# EAGLE board board-scope-R3 (EAGLE 9.0.0), part 1 of 2
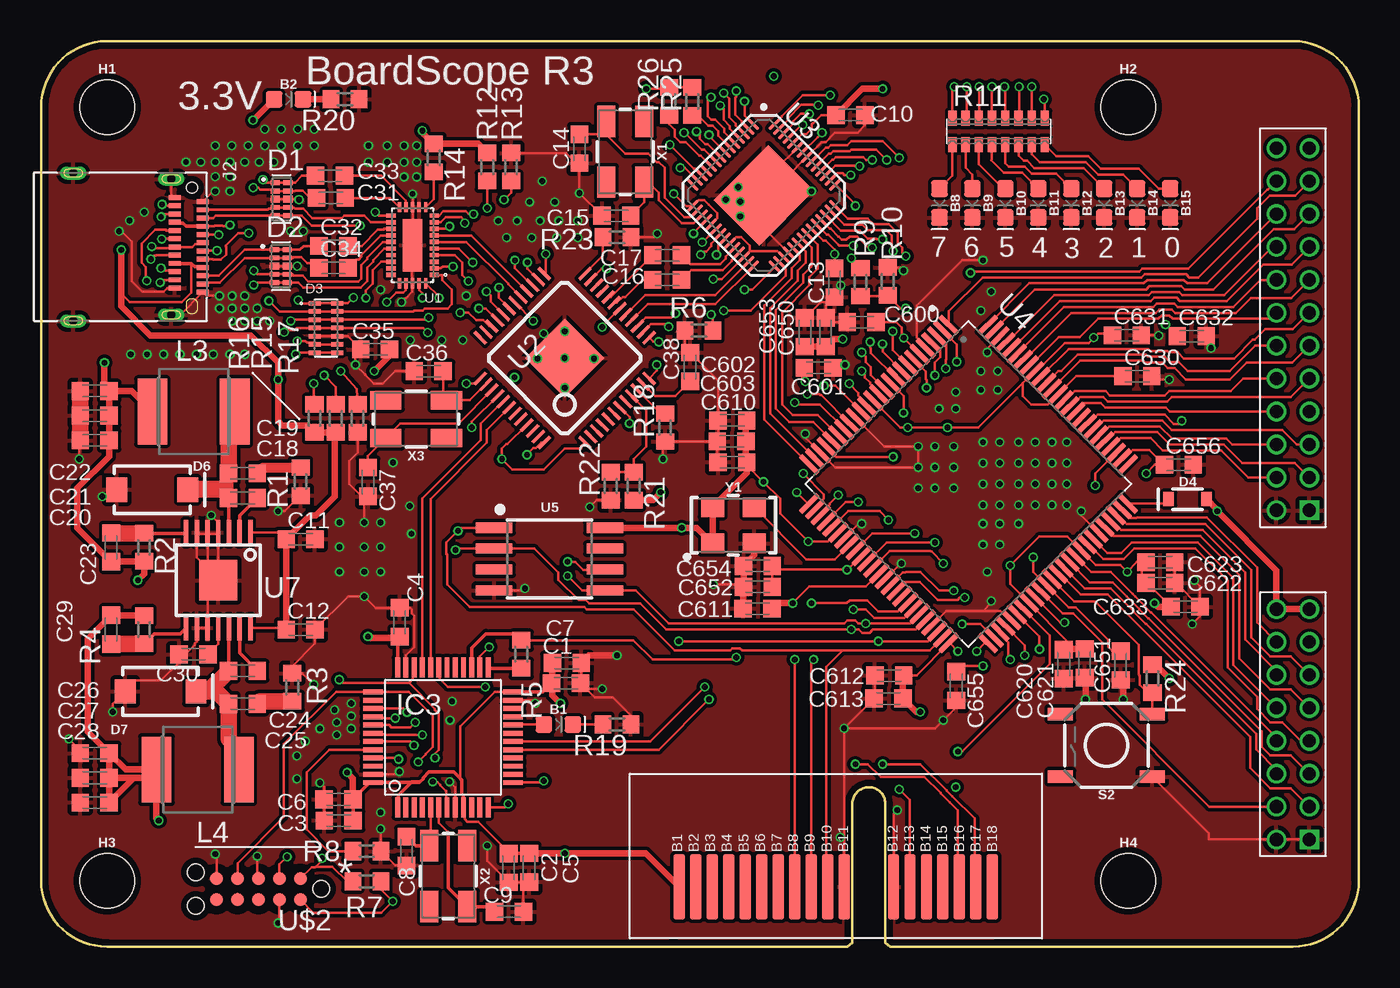
[diagram p5: board, top side]
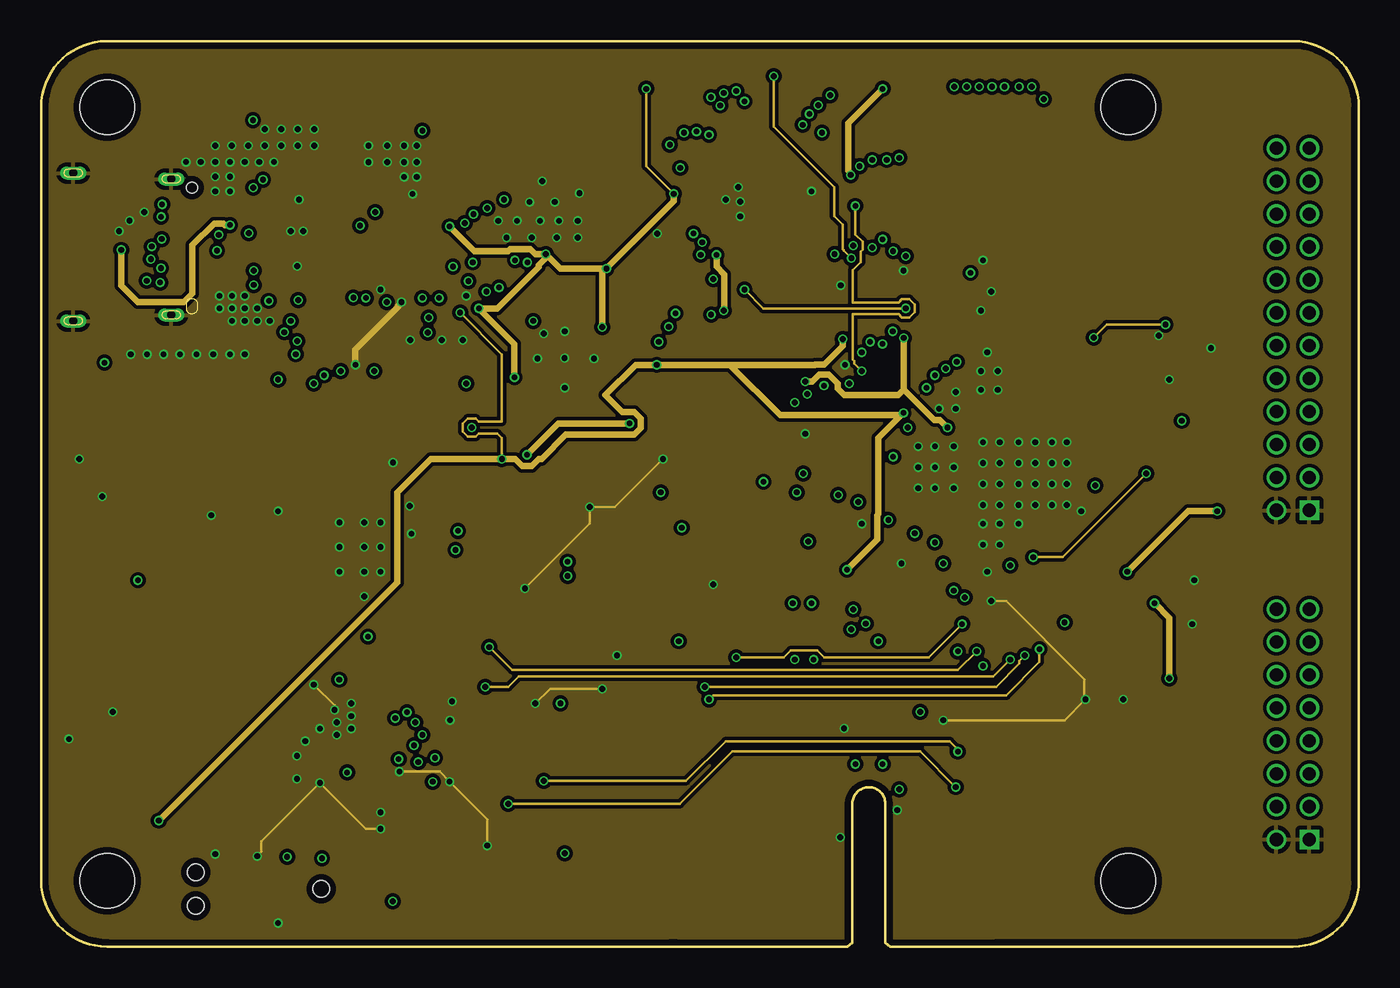
[diagram p6: board, inner layer Route2]
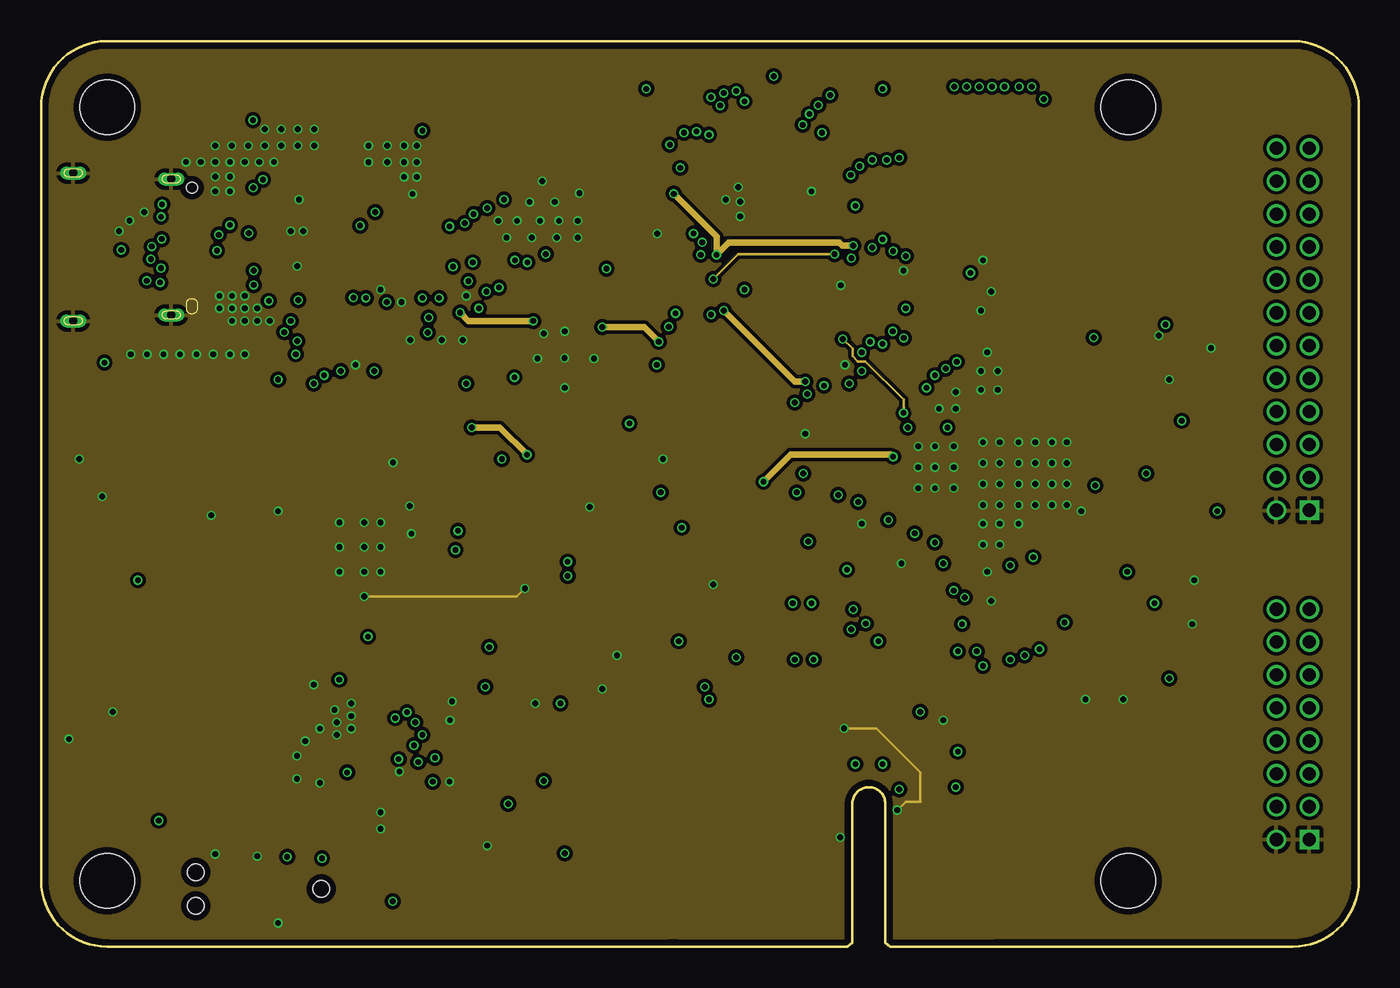
[diagram p7: board, inner layer Route15]
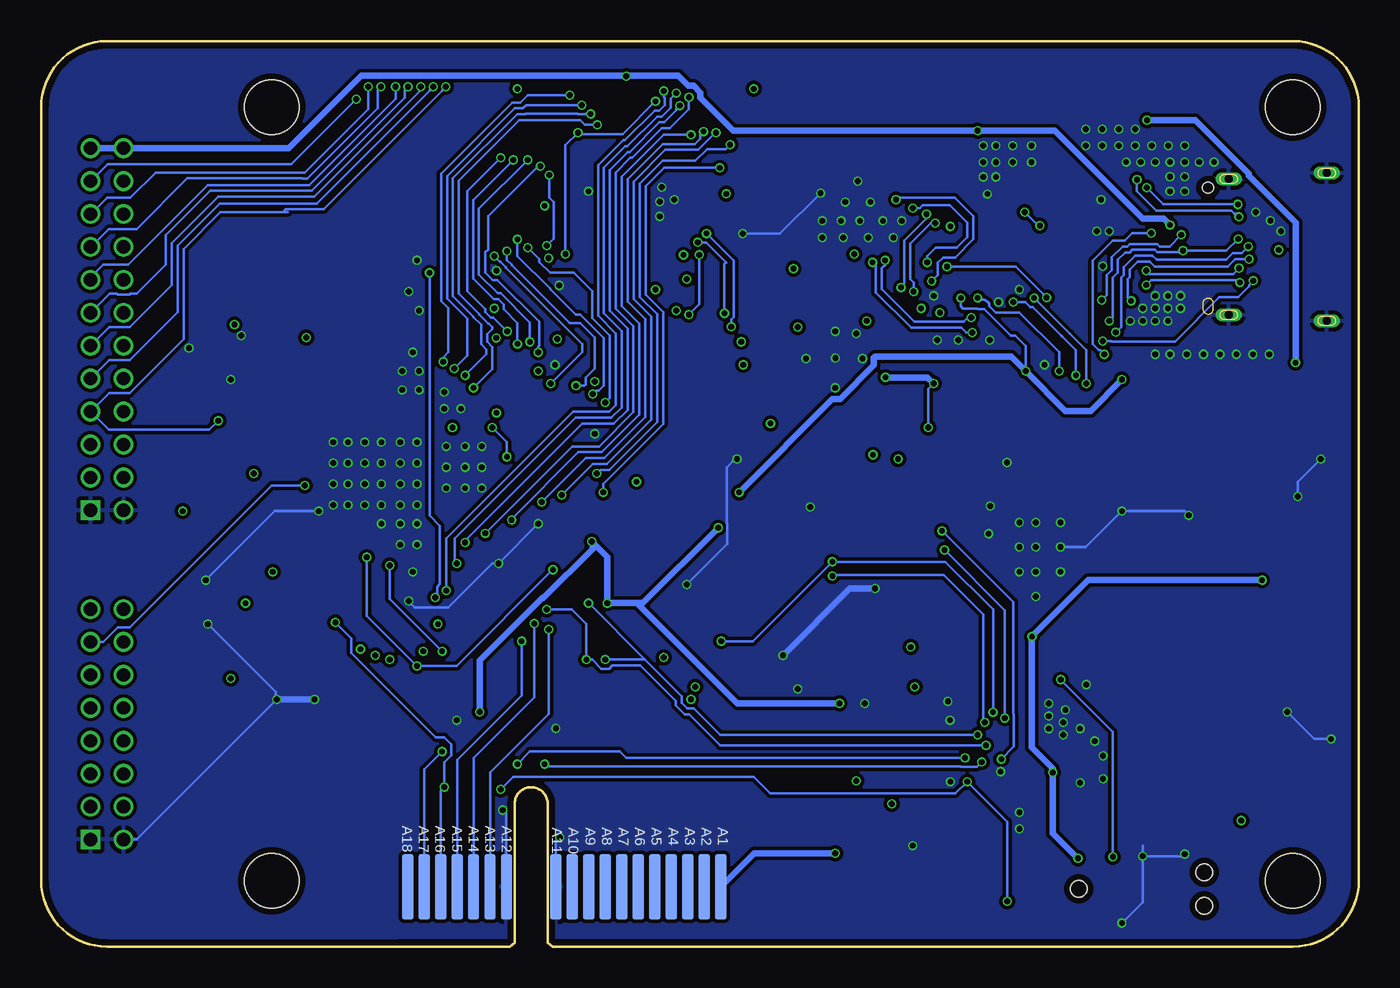
[diagram p8: board, bottom side, seen from below]

Size 80 x 55 mm. Coordinates in mm from the lower left corner, seen from the top.
Outline: 38.5,0 4,0 arc-90 0,4 0,51 arc-90 4,55 76,55 arc-90 80,51 80,4 arc-90 76,0 58,0
Copper layers (1*2*15*16): Top 0.035559375mm / dielectric 0.17018125mm / Route2 0.01778125mm / dielectric 47mil / Route15 0.01778125mm / dielectric 0.17018125mm / Bottom 0.035559375mm
Design rules "oshpark-4layer": minimum track width 5mil, minimum drill 10mil, track to track 5mil, track to pad 5mil, pad to pad 5mil, via to via 5mil, smd to smd 5mil, copper to edge 15mil, drill to drill 6mil, minimum pad ring 4mil, minimum via ring 4mil, stop-mask expansion 2.5mil, vias tented up to drill 0.5mm, thermal gap 10mil
Net classes: 0 default: width 0.152 mm, clearance 0.205 mm

## Footprints (pad centres in the part's own frame; a part is rotated, then mirrored left to right if it is on the bottom)
LED-0603 = smd 1 x 1: A -0.877,0; C 0.877,0
C0603K = smd 1.05 x 1.08: 1 -0.875,0; 2 0.875,0
TI_TPD4E05U06DQAR = smd 0.55 x 0.3: 1 -0.385,1; 2 -0.385,0.5; 4 -0.385,-0.5; 5 -0.385,-1; 6 0.385,-1; 7 0.385,-0.5; 9 0.385,0.5; 10 0.385,1 | smd 0.55 x 0.4: 3 -0.385,0; 8 0.385,0
SON50P135X350X55-14N = smd 0.74 x 0.22: 1 -0.67,1.5; 2 -0.67,1; 3 -0.67,0.5; 4 -0.67,0; 5 -0.67,-0.5; 6 -0.67,-1; 7 -0.67,-1.5; 8 0.67,-1.5; 9 0.67,-1; 10 0.67,-0.5; 11 0.67,0; 12 0.67,0.5; 13 0.67,1; 14 0.67,1.5
SOD-323 = smd 0.63 x 0.83: A 1.15,0; C -1.15,0
SMA-DIODE = smd 1.27 x 1.47: A -2.15,0; C 2.15,0
STAND-OFF = hole 3.302: 0,0
LQFP48 = smd 0.3 x 1.2: 1 -2.75,-4.25; 2 -2.25,-4.25; 3 -1.75,-4.25; 4 -1.25,-4.25; 5 -0.75,-4.25; 6 -0.25,-4.25; 7 0.25,-4.25; 8 0.75,-4.25; 9 1.25,-4.25; 10 1.75,-4.25; 11 2.25,-4.25; 12 2.75,-4.25; 25 2.75,4.25; 26 2.25,4.25; 27 1.75,4.25; 28 1.25,4.25; 29 0.75,4.25; 30 0.25,4.25; 31 -0.25,4.25; 32 -0.75,4.25; 33 -1.25,4.25; 34 -1.75,4.25; 35 -2.25,4.25; 36 -2.75,4.25 | smd 1.2 x 0.3: 13 4.25,-2.75; 14 4.25,-2.25; 15 4.25,-1.75; 16 4.25,-1.25; 17 4.25,-0.75; 18 4.25,-0.25; 19 4.25,0.25; 20 4.25,0.75; 21 4.25,1.25; 22 4.25,1.75; 23 4.25,2.25; 24 4.25,2.75; 37 -4.25,2.75; 38 -4.25,2.25; 39 -4.25,1.75; 40 -4.25,1.25; 41 -4.25,0.75; 42 -4.25,0.25; 43 -4.25,-0.25; 44 -4.25,-0.75; 45 -4.25,-1.25; 46 -4.25,-1.75; 47 -4.25,-2.25; 48 -4.25,-2.75
AMPHENOL_12401598E4#2A = smd 0.3 x 0.7: A1 -2.75,0.66; A2 -2.25,0.66; A3 -1.75,0.66; A4 -1.25,0.66; A5 -0.75,0.66; A6 -0.25,0.66; A7 0.25,0.66; A8 0.75,0.66; A9 1.25,0.66; A10 1.75,0.66; A11 2.25,0.66; A12 2.75,0.66; B1 2.5,-1.04; B2 2,-1.04; B3 1.5,-1.04; B4 1,-1.04; B5 0.5,-1.04; B6 0,-1.04; B7 -0.5,-1.04; B8 -1,-1.04; B9 -1.5,-1.04; B10 -2,-1.04; B11 -2.5,-1.04; B12 -3,-1.04 | drill 0.5 pad 0.8 long: SH1 -4.13,-1.25; SH2 -4.49,-7.2; SH3 4.49,-7.2; SH4 4.13,-1.25 | hole 0.65: -3.6,0
L5650M = smd 1.8 x 4: 1 -2.5,0; 2 2.5,0
R0603 = smd 1 x 1.1: 1 -0.85,0; 2 0.85,0
CTS743C163 = smd 0.5 x 0.9: 1 -2.8,-0.8; 2 -2,-0.8; 3 -1.2,-0.8; 4 -0.4,-0.8; 5 0.41,-0.8; 6 1.21,-0.8; 7 2.01,-0.8; 8 2.81,-0.8; 9 2.81,0.8; 10 2.01,0.8; 11 1.21,0.8; 12 0.41,0.8; 13 -0.4,0.8; 14 -1.2,0.8; 15 -2,0.8; 16 -2.8,0.8
TACTILE_SWITCH_SMD_5.2MM = smd 1.524 x 0.762: 1 -2.794,1.905; 2 2.794,1.905; 3 -2.794,-1.905; 4 2.794,-1.905
QFN40P450X250X80-31N120X320 = smd 0.58 x 0.22: 1 -1.315,1.8; 2 -1.315,1.4; 3 -1.315,1; 4 -1.315,0.6; 5 -1.315,0.2; 6 -1.315,-0.2; 7 -1.315,-0.6; 8 -1.315,-1; 9 -1.315,-1.4; 10 -1.315,-1.8; 16 1.315,-1.8; 17 1.315,-1.4; 18 1.315,-1; 19 1.315,-0.6; 20 1.315,-0.2; 21 1.315,0.2; 22 1.315,0.6; 23 1.315,1; 24 1.315,1.4; 25 1.315,1.8 | smd 0.22 x 0.58: 11 -0.8,-2.315; 12 -0.4,-2.315; 13 0,-2.315; 14 0.4,-2.315; 15 0.8,-2.315; 26 0.8,2.315; 27 0.4,2.315; 28 0,2.315; 29 -0.4,2.315; 30 -0.8,2.315 | smd 1.2 x 3.2: 31 0,0
TQFP48 = smd 0.2 x 1: 1 -2.75,-4.5; 2 -2.25,-4.5; 3 -1.75,-4.5; 4 -1.25,-4.5; 5 -0.75,-4.5; 6 -0.25,-4.5; 7 0.25,-4.5; 8 0.75,-4.5; 9 1.25,-4.5; 10 1.75,-4.5; 11 2.25,-4.5; 12 2.75,-4.5; 25 2.75,4.5; 26 2.25,4.5; 27 1.75,4.5; 28 1.25,4.5; 29 0.75,4.5; 30 0.25,4.5; 31 -0.25,4.5; 32 -0.75,4.5; 33 -1.25,4.5; 34 -1.75,4.5; 35 -2.25,4.5; 36 -2.75,4.5 | smd 1 x 0.2: 13 4.5,-2.75; 14 4.5,-2.25; 15 4.5,-1.75; 16 4.5,-1.25; 17 4.5,-0.75; 18 4.5,-0.25; 19 4.5,0.25; 20 4.5,0.75; 21 4.5,1.25; 22 4.5,1.75; 23 4.5,2.25; 24 4.5,2.75; 37 -4.5,2.75; 38 -4.5,2.25; 39 -4.5,1.75; 40 -4.5,1.25; 41 -4.5,0.75; 42 -4.5,0.25; 43 -4.5,-0.25; 44 -4.5,-0.75; 45 -4.5,-1.25; 46 -4.5,-1.75; 47 -4.5,-2.25; 48 -4.5,-2.75 | smd 3.4 x 3.4: P$1 0,0
VQFN-56-7MM = smd 1 x 0.2: 1 -3.55,2.6; 2 -3.55,2.2; 3 -3.55,1.8; 4 -3.55,1.4; 5 -3.55,1; 6 -3.55,0.6; 7 -3.55,0.2; 8 -3.55,-0.2; 9 -3.55,-0.6; 10 -3.55,-1; 11 -3.55,-1.4; 12 -3.55,-1.8; 13 -3.55,-2.2; 14 -3.55,-2.6; 29 3.55,-2.6; 30 3.55,-2.2; 31 3.55,-1.8; 32 3.55,-1.4; 33 3.55,-1; 34 3.55,-0.6; 35 3.55,-0.2; 36 3.55,0.2; 37 3.55,0.6; 38 3.55,1; 39 3.55,1.4; 40 3.55,1.8; 41 3.55,2.2; 42 3.55,2.6 | smd 0.2 x 1: 15 -2.6,-3.55; 16 -2.2,-3.55; 17 -1.8,-3.55; 18 -1.4,-3.55; 19 -1,-3.55; 20 -0.6,-3.55; 21 -0.2,-3.55; 22 0.2,-3.55; 23 0.6,-3.55; 24 1,-3.55; 25 1.4,-3.55; 26 1.8,-3.55; 27 2.2,-3.55; 28 2.6,-3.55; 43 2.6,3.55; 44 2.2,3.55; 45 1.8,3.55; 46 1.4,3.55; 47 1,3.55; 48 0.6,3.55; 49 0.2,3.55; 50 -0.2,3.55; 51 -0.6,3.55; 52 -1,3.55; 53 -1.4,3.55; 54 -1.8,3.55; 55 -2.2,3.55; 56 -2.6,3.55 | smd 3.9 x 4.7: PAD 0,0
QFP50P1600X1600X120-100N = smd 1.47 x 0.28: 1 -7.67,6; 2 -7.67,5.5; 3 -7.67,5; 4 -7.67,4.5; 5 -7.67,4; 6 -7.67,3.5; 7 -7.67,3; 8 -7.67,2.5; 9 -7.67,2; 10 -7.67,1.5; 11 -7.67,1; 12 -7.67,0.5; 13 -7.67,0; 14 -7.67,-0.5; 15 -7.67,-1; 16 -7.67,-1.5; 17 -7.67,-2; 18 -7.67,-2.5; 19 -7.67,-3; 20 -7.67,-3.5; 21 -7.67,-4; 22 -7.67,-4.5; 23 -7.67,-5; 24 -7.67,-5.5; 25 -7.67,-6; 51 7.67,-6; 52 7.67,-5.5; 53 7.67,-5; 54 7.67,-4.5; 55 7.67,-4; 56 7.67,-3.5; 57 7.67,-3; 58 7.67,-2.5; 59 7.67,-2; 60 7.67,-1.5; 61 7.67,-1; 62 7.67,-0.5; 63 7.67,0; 64 7.67,0.5; 65 7.67,1; 66 7.67,1.5; 67 7.67,2; 68 7.67,2.5; 69 7.67,3; 70 7.67,3.5; 71 7.67,4; 72 7.67,4.5; 73 7.67,5; 74 7.67,5.5; 75 7.67,6 | smd 0.28 x 1.47: 26 -6,-7.67; 27 -5.5,-7.67; 28 -5,-7.67; 29 -4.5,-7.67; 30 -4,-7.67; 31 -3.5,-7.67; 32 -3,-7.67; 33 -2.5,-7.67; 34 -2,-7.67; 35 -1.5,-7.67; 36 -1,-7.67; 37 -0.5,-7.67; 38 0,-7.67; 39 0.5,-7.67; 40 1,-7.67; 41 1.5,-7.67; 42 2,-7.67; 43 2.5,-7.67; 44 3,-7.67; 45 3.5,-7.67; 46 4,-7.67; 47 4.5,-7.67; 48 5,-7.67; 49 5.5,-7.67; 50 6,-7.67; 76 6,7.67; 77 5.5,7.67; 78 5,7.67; 79 4.5,7.67; 80 4,7.67; 81 3.5,7.67; 82 3,7.67; 83 2.5,7.67; 84 2,7.67; 85 1.5,7.67; 86 1,7.67; 87 0.5,7.67; 88 0,7.67; 89 -0.5,7.67; 90 -1,7.67; 91 -1.5,7.67; 92 -2,7.67; 93 -2.5,7.67; 94 -3,7.67; 95 -3.5,7.67; 96 -4,7.67; 97 -4.5,7.67; 98 -5,7.67; 99 -5.5,7.67; 100 -6,7.67
SO08-EIAJ = smd 0.61 x 2.21: 1 -1.905,-3.378; 2 -0.635,-3.378; 3 0.635,-3.378; 4 1.905,-3.378; 5 1.905,3.353; 6 0.635,3.353; 7 -0.635,3.353; 8 -1.905,3.353
HTSSOP14PWP = smd 0.27 x 1.5: 1 -1.95,-2.9; 2 -1.3,-2.9; 3 -0.65,-2.9; 4 0,-2.9; 5 0.65,-2.9; 6 1.3,-2.9; 7 1.95,-2.9; 8 1.95,2.9; 9 1.3,2.9; 10 0.65,2.9; 11 0,2.9; 12 -0.65,2.9; 13 -1.3,2.9; 14 -1.95,2.9 | smd 2.31 x 2.46: EXP 0,0
PCI-E_36_EDGE_MID = smd 0.7 x 4 bottom: A1 0.5,3.63; A2 1.5,3.63; A3 2.5,3.63; A4 3.5,3.63; A5 4.5,3.63; A6 5.5,3.63; A7 6.5,3.63; A8 7.5,3.63; A9 8.5,3.63; A10 9.5,3.63; A11 10.5,3.63; A12 13.5,3.63; A13 14.5,3.63; A14 15.5,3.63; A15 16.5,3.63; A16 17.5,3.63; A17 18.5,3.63; A18 19.5,3.63 | smd 0.7 x 4: B1 0.5,3.63; B2 1.5,3.63; B3 2.5,3.63; B4 3.5,3.63; B5 4.5,3.63; B6 5.5,3.63; B7 6.5,3.63; B8 7.5,3.63; B9 8.5,3.63; B10 9.5,3.63; B11 10.5,3.63; B12 13.5,3.63; B13 14.5,3.63; B14 15.5,3.63; B15 16.5,3.63; B16 17.5,3.63; B17 18.5,3.63; B18 19.5,3.63
TC2030-MCP-NL = smd 0.787 x 0.787: 1 1.27,-0.635; 2 2.54,-0.635; 3 3.81,-0.635; 4 5.08,-0.635; 5 6.35,-0.635; 6 6.35,0.635; 7 5.08,0.635; 8 3.81,0.635; 9 2.54,0.635; 10 1.27,0.635; 11 1.27,0.635; 12 1.27,0.635 | hole 1: 0,0; 7.62,-1.016; 7.62,1.016
2X8_2MM = drill 0.8 square: P$1 0,0 | drill 0.8: P$2 0,2; P$3 2,0; P$4 2,2; P$5 4,0; P$6 4,2; P$7 6,0; P$8 6,2; P$9 8,0; P$10 8,2; P$11 10,0; P$12 10,2; P$13 12,0; P$14 12,2; P$15 14,0; P$16 14,2
2X12_2MM = drill 0.8 square: P$1 0,0 | drill 0.8: P$2 0,2; P$3 2,0; P$4 2,2; P$5 4,0; P$6 4,2; P$7 6,0; P$8 6,2; P$9 8,0; P$10 8,2; P$11 10,0; P$12 10,2; P$13 12,0; P$14 12,2; P$15 14,0; P$16 14,2; P$17 16,0; P$18 16,2; P$19 18,0; P$20 18,2; P$21 20,0; P$22 20,2; P$23 22,0; P$24 22,2
CRYSTAL-SMD-5X3.2-4PAD = smd 1.9 x 1.1: 1 -1.85,-1.15; 2 1.85,-1.15; 3 1.85,1.15; 4 -1.85,1.15
OSCILLATOR-SMD-5X3.2 = smd 1.397 x 1.194: 1 -1.27,-1.1; 2 1.27,-1.1; 3 1.27,1.1; 4 -1.27,1.1

## Placement (x,y rotation side)
B1  [LED-0603]  31.4,13.5 0 top
B2  [LED-0603]  15.02,51.47 0 top
B8  [LED-0603]  54.54,45.16 270 top
B9  [LED-0603]  56.54,45.16 270 top
B10  [LED-0603]  58.54,45.16 270 top
B11  [LED-0603]  60.54,45.16 270 top
B12  [LED-0603]  62.54,45.16 270 top
B13  [LED-0603]  64.54,45.16 270 top
B14  [LED-0603]  66.54,45.16 270 top
B15  [LED-0603]  68.54,45.16 270 top
C1  0.1uF  [C0603K]  31.87,16 0 top
C2  0.1uF  [C0603K]  28.38,4.78 270 top
C3  0.1uF  [C0603K]  18.07,7.65 180 top
C4  0.1uF  [C0603K]  21.77,19.71 90 top
C5  0.1uF  [C0603K]  29.63,4.79 270 top
C6  1uF  [C0603K]  18.05,8.94 180 top
C7  4.7uF  [C0603K]  31.91,17.23 0 top
C8  8Pf  [C0603K]  22.18,5.8 270 top
C9  8Pf  [C0603K]  28.4,2.12 0 top
C10  0.1uF  [C0603K]  49.14,50.51 0 top
C11  22uF  [C0603K]  15.75,24.75 0 top
C12  22uF  [C0603K]  15.75,19.25 0 top
C13  4.7uF  [C0603K]  48.17,40.32 270 top
C14  8Pf  [C0603K]  32.68,48.47 270 top
C15  8Pf  [C0603K]  34.93,44.39 180 top
C16  0.1uF  [C0603K]  38,40.5 180 top
C17  0.1uF  [C0603K]  38,42 180 top
C18  33nF  [C0603K]  12.25,27.25 0 top
C19  0.47uF  [C0603K]  12.25,28.75 0 top
C20  47uF  [C0603K]  3.25,30.75 180 top
C21  22uF  [C0603K]  3.25,32.25 180 top
C22  22uF  [C0603K]  3.25,33.75 180 top
C23  100pF  [C0603K]  4.25,24.25 90 top
C24  33nF  [C0603K]  12.25,16.75 0 top
C25  0.47uF  [C0603K]  12.25,14.75 0 top
C26  47uF  [C0603K]  3.25,11.75 180 top
C27  22uF  [C0603K]  3.25,10.25 180 top
C28  22uF  [C0603K]  3.25,8.75 180 top
C29  150pF  [C0603K]  4.25,19.25 270 top
C30  47uF  [C0603K]  9.25,17.75 180 top
C31  0.47uF  [C0603K]  17.59,45.47 0 top
C32  0.47uF  [C0603K]  17.75,42.56 0 top
C33  0.47uF  [C0603K]  17.54,46.82 0 top
C34  0.47uF  [C0603K]  17.75,41.23 0 top
C35  47uF  [C0603K]  20.28,36.28 180 top
C36  18pF  [C0603K]  23.53,34.96 180 top
C37  18pF  [C0603K]  19.84,28.23 270 top
C38  1uF  [C0603K]  39.4,35.21 90 top
C600  1uF  [C0603K]  49.82,37.93 180 top
C601  0.1uF  [C0603K]  47.2,35.16 0 top
C602  10nF  [C0603K]  41.97,31.96 180 top
C603  10nF  [C0603K]  41.92,30.69 180 top
C610  1uF  [C0603K]  41.97,29.42 180 top
C611  0.1uF  [C0603K]  43.49,20.53 180 top
C612  10nF  [C0603K]  51.49,16.47 180 top
C613  10nF  [C0603K]  51.44,15.07 180 top
C620  1uF  [C0603K]  62.09,17.15 270 top
C621  0.1uF  [C0603K]  63.36,17.2 270 top
C622  10nF  [C0603K]  67.95,22.08 0 top
C623  10nF  [C0603K]  67.95,23.35 0 top
C630  1uF  [C0603K]  66.56,34.65 0 top
C631  0.1uF  [C0603K]  65.92,37.13 0 top
C632  10nF  [C0603K]  69.86,37.08 0 top
C633  10nF  [C0603K]  69.48,20.64 0 top
C650  1uF  [C0603K]  47.63,37.32 90 top
C651  1uF  [C0603K]  65.54,17.08 270 top
C652  0.1uF  [C0603K]  43.52,21.85 180 top
C653  0.1uF  [C0603K]  46.36,37.32 90 top
C654  10nF  [C0603K]  43.52,23.12 180 top
C655  10nF  [C0603K]  55.56,15.83 270 top
C656  10nF  [C0603K]  69.07,29.27 0 top
D1  TPD4E05U06DQAR  [TI_TPD4E05U06DQAR]  14.6,45.4 0 top
D2  TPD4E05U06DQAR  [TI_TPD4E05U06DQAR]  14.55,41.33 0 top
D3  TPD6E05U06RVZR  [SON50P135X350X55-14N]  17.29,37.58 0 top
D4  1A/23V/620mV  [SOD-323]  69.6,27.19 0 top
D6  3A/40V/500mV  [SMA-DIODE]  6.75,27.75 0 top
D7  3A/40V/500mV  [SMA-DIODE]  7.25,15.5 0 top
H1  STAND-OFF  [STAND-OFF]  4,51 0 top
H2  STAND-OFF  [STAND-OFF]  66,51 0 top
H3  STAND-OFF  [STAND-OFF]  4,4 0 top
H4  STAND-OFF  [STAND-OFF]  66,4 0 top
IC3  STM32F103C8T  [LQFP48]  24.39,12.71 0 top
J2  12401598E4#2A  [AMPHENOL_12401598E4#2A]  9.15,42.5 270 top
L3  8.2uH  [L5650M]  9.25,32.5 180 top
L4  8.2uH  [L5650M]  9.5,10.75 180 top
R1  10  [R0603]  15.75,28.25 90 top
R2  20k  [R0603]  6.25,24.25 270 top
R3  10  [R0603]  15.25,15.75 270 top
R4  10k  [R0603]  6.25,19.25 90 top
R5  100  [R0603]  29.15,17.76 270 top
R6  1.6k 1%  [R0603]  39.94,37.42 0 top
R7  10k  [R0603]  19.77,3.97 180 top
R8  10k  [R0603]  19.77,5.8 180 top
R9  4.7k  [R0603]  49.74,40.36 90 top
R10  10k  [R0603]  51.4,40.41 270 top
R11  330  [CTS743C163]  58.13,49.51 0 top
R12  900k  [R0603]  27.08,47.35 90 top
R13  4.7k  [R0603]  28.53,47.35 270 top
R14  200k  [R0603]  23.83,47.91 270 top
R15  200k  [R0603]  17.89,32.09 90 top
R16  200k  [R0603]  16.59,32.09 90 top
R17  4.7k  [R0603]  19.21,32.09 270 top
R18  900k  [R0603]  37.88,31.53 90 top
R19  330  [R0603]  34.96,13.5 180 top
R20  330  [R0603]  18.45,51.47 180 top
R21  90.9k  [R0603]  35.97,27.97 270 top
R22  10k  [R0603]  34.58,27.97 90 top
R23  9.09k 1%  [R0603]  34.96,43.09 180 top
R24  10k  [R0603]  67.47,16.29 90 top
R25  10k  [R0603]  39.53,51.34 90 top
R26  10k  [R0603]  38.13,51.34 90 top
S2  [TACTILE_SWITCH_SMD_5.2MM]  64.68,12.23 180 top
U1  HD3SS3220IRNHT  [QFN40P450X250X80-31N120X320]  22.55,42.6 180 top
U2  TUSB8020B  [TQFP48]  31.78,35.75 45 top
U3  FT600Q-T  [VQFN-56-7MM]  43.87,45.63 315 top
U4  ICE40HX1K-VQ100  [QFP50P1600X1600X120-100N]  56.29,28.1 315 top
U5  25F32006WSOI  [SO08-EIAJ]  30.87,23.54 270 top
U7  TPS54386  [HTSSOP14PWP]  10.75,22.25 180 top
U$1  EDGE_DEBUG  [PCI-E_36_EDGE_MID]  38.25,0 0 top
U$2  TC2050-NL-MCP-NL  [TC2030-MCP-NL]  17,3.5 180 top
U$3  2X8_2MM  [2X8_2MM]  77,6.5 90 top
U$4  2X12_2MM  [2X12_2MM]  77,26.5 90 top
X1  30Mhz  [CRYSTAL-SMD-5X3.2-4PAD]  35.46,48.28 270 top
X2  8Mhz  [CRYSTAL-SMD-5X3.2-4PAD]  24.72,4.28 270 top
X3  24Mhz  [CRYSTAL-SMD-5X3.2-4PAD]  22.77,32.04 180 top
Y1  OSCILLATORSMD-5X3  [OSCILLATOR-SMD-5X3.2]  42.03,25.59 0 top